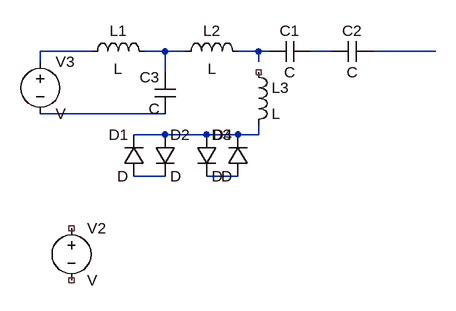
[diagram p0: schematic Mixer.asc]
Mixer.asc, the LTspice schematic file:
Version 4
SHEET 1 880 680
WIRE -32 -48 -112 -48
WIRE 80 -48 48 -48
WIRE 112 -48 80 -48
WIRE 224 -48 192 -48
WIRE 240 -48 224 -48
WIRE 336 -48 304 -48
WIRE 496 -48 400 -48
WIRE -112 -32 -112 -48
WIRE 224 -32 224 -48
WIRE 80 -16 80 -48
WIRE 80 48 -112 48
WIRE 80 80 32 80
WIRE 144 80 80 80
WIRE 192 80 144 80
WIRE 224 80 224 64
WIRE 224 80 192 80
WIRE 80 144 32 144
WIRE 192 144 144 144
SYMBOL voltage -64 208 R0
SYMATTR InstName V2
SYMBOL voltage -112 -48 R0
SYMATTR InstName V3
SYMBOL ind -48 -32 R270
WINDOW 0 32 56 VTop 2
WINDOW 3 5 56 VBottom 2
SYMATTR InstName L1
SYMBOL ind 96 -32 R270
WINDOW 0 32 56 VTop 2
WINDOW 3 5 56 VBottom 2
SYMATTR InstName L2
SYMBOL cap 304 -64 R90
WINDOW 0 0 32 VBottom 2
WINDOW 3 32 32 VTop 2
SYMATTR InstName C1
SYMBOL cap 400 -64 R90
WINDOW 0 0 32 VBottom 2
WINDOW 3 32 32 VTop 2
SYMATTR InstName C2
SYMBOL cap 96 48 R180
WINDOW 0 24 56 Left 2
WINDOW 3 24 8 Left 2
SYMATTR InstName C3
SYMBOL ind 208 -32 R0
SYMATTR InstName L3
SYMBOL diode 48 144 R180
WINDOW 0 24 64 Left 2
WINDOW 3 24 0 Left 2
SYMATTR InstName D1
SYMBOL diode 64 80 R0
SYMATTR InstName D2
SYMBOL diode 128 80 R0
SYMATTR InstName D3
SYMBOL diode 208 144 R180
WINDOW 0 24 64 Left 2
WINDOW 3 24 0 Left 2
SYMATTR InstName D4

The netlist it stands for:
* Mixer.asc
V2 NC_01 NC_02 V
V3 N001 N006 V
L1 N001 N002 L
L2 N002 N003 L
C1 N004 N003 C
C2 N005 N004 C
C3 N006 N002 C
L3 NC_03 N007 L
D1 N008 N007 D
D2 N007 N008 D
D3 N007 N009 D
D4 N009 N007 D
.model D D
.lib standard.dio
.backanno
.end